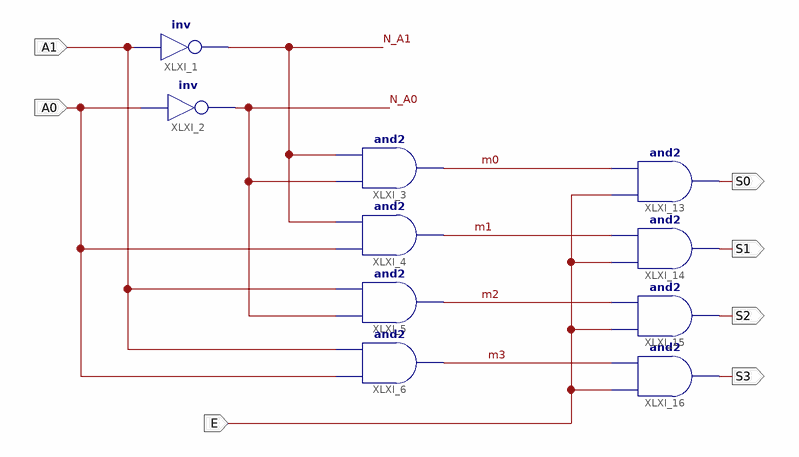
[diagram p0: schematic sheet 1]
// Xilinx ISE schematic decod2a4.sch (spartan3e) as structural Verilog: 10 symbols, 7 ports
module decod2a4 (
  input  A1,
  input  A0,
  input  E,
  output S0,
  output S1,
  output S2,
  output S3
);

  wire m0, m1, m2, m3, N_A0, N_A1;

  and XLXI_3 (m0, N_A0, N_A1);
  and XLXI_4 (m1, A0, N_A1);
  and XLXI_5 (m2, N_A0, A1);
  and XLXI_6 (m3, A0, A1);
  not XLXI_1 (N_A1, A1);
  not XLXI_2 (N_A0, A0);
  and XLXI_16 (S3, E, m3);
  and XLXI_15 (S2, E, m2);
  and XLXI_14 (S1, E, m1);
  and XLXI_13 (S0, E, m0);
endmodule
